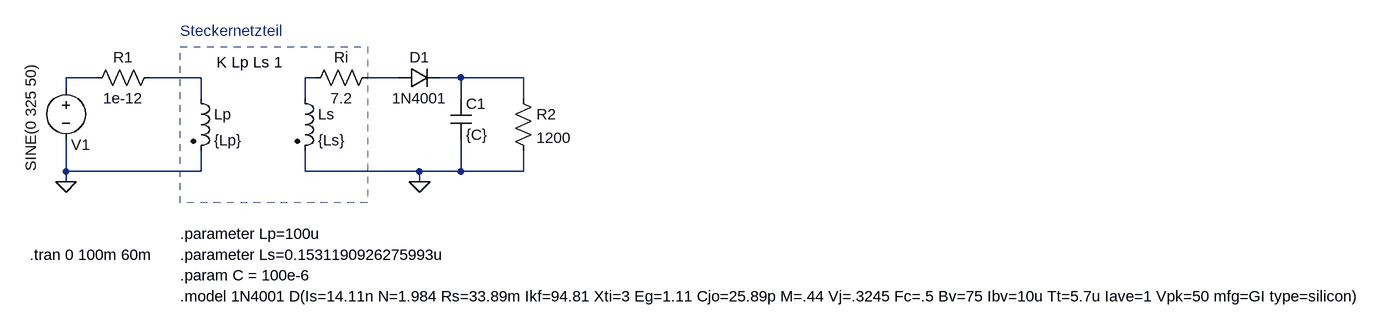
[diagram p0: schematic 101_lec_exercise_diode_einweg.asc]
101_lec_exercise_diode_einweg.asc, the LTspice schematic file:
Version 4
SHEET 1 2120 680
WIRE -48 48 -96 48
WIRE 112 48 32 48
WIRE 288 48 272 48
WIRE 416 48 368 48
WIRE 512 48 480 48
WIRE 608 48 512 48
WIRE -96 64 -96 48
WIRE 112 80 112 48
WIRE 272 80 272 48
WIRE 512 80 512 48
WIRE 608 80 608 48
WIRE -96 192 -96 144
WIRE 112 192 112 160
WIRE 112 192 -96 192
WIRE 272 192 272 160
WIRE 448 192 272 192
WIRE 512 192 512 144
WIRE 512 192 448 192
WIRE 608 192 608 160
WIRE 608 192 512 192
WIRE -96 208 -96 192
WIRE 448 208 448 192
FLAG -96 208 0
FLAG 448 208 0
SYMBOL voltage -96 48 R0
WINDOW 0 8 103 Left 2
WINDOW 3 -54 144 VLeft 2
WINDOW 123 0 0 Left 2
WINDOW 39 0 0 Left 2
SYMATTR InstName V1
SYMATTR Value SINE(0 325 50)
SYMBOL ind2 96 64 R0
SYMATTR InstName Lp
SYMATTR Value {Lp}
SYMATTR Type ind
SYMBOL ind2 256 64 R0
SYMATTR InstName Ls
SYMATTR Value {Ls}
SYMATTR Type ind
SYMBOL res 48 32 R90
WINDOW 0 0 56 VBottom 2
WINDOW 3 32 56 VTop 2
SYMATTR InstName R1
SYMATTR Value 1e-12
SYMBOL res 384 32 R90
WINDOW 0 0 56 VBottom 2
WINDOW 3 32 56 VTop 2
SYMATTR InstName Ri
SYMATTR Value 7.2
SYMBOL diode 416 64 R270
WINDOW 0 32 32 VTop 2
WINDOW 3 0 32 VBottom 2
SYMATTR InstName D1
SYMATTR Value 1N4001
SYMBOL cap 496 80 R0
SYMATTR InstName C1
SYMATTR Value {C}
SYMBOL res 592 64 R0
SYMATTR InstName R2
SYMATTR Value 1200
TEXT 136 24 Left 2 !K Lp Ls 1
TEXT 80 -24 Left 2 ;Steckernetzteil
TEXT 80 288 Left 2 !.parameter Lp=100u
TEXT 80 320 Left 2 !.parameter Ls=0.1531190926275993u
TEXT -152 320 Left 2 !.tran 0 100m 60m
TEXT 80 352 Left 2 !.param C = 100e-6
TEXT 80 384 Left 2 !.model 1N4001 D(Is=14.11n N=1.984 Rs=33.89m Ikf=94.81 Xti=3 Eg=1.11 Cjo=25.89p M=.44 Vj=.3245 Fc=.5 Bv=75 Ibv=10u Tt=5.7u Iave=1 Vpk=50 mfg=GI type=silicon)
RECTANGLE Normal 368 240 80 0 2

The netlist it stands for:
* 101_lec_exercise_diode_einweg.asc
V1 N001 0 SINE(0 325 50)
Lp N002 0 {Lp}
Ls N003 0 {Ls}
R1 N002 N001 1e-12
Ri N004 N003 7.2
D1 N004 N005 1N4001
C1 N005 0 {C}
R2 N005 0 1200
.model D D
.lib standard.dio
K Lp Ls 1
* Steckernetzteil
.parameter Lp=100u
.parameter Ls=0.1531190926275993u
.tran 0 100m 60m
.param C = 100e-6
.model 1N4001 D(Is=14.11n N=1.984 Rs=33.89m Ikf=94.81 Xti=3 Eg=1.11 Cjo=25.89p M=.44 Vj=.3245 Fc=.5 Bv=75 Ibv=10u Tt=5.7u Iave=1 Vpk=50 mfg=GI type=silicon)
.backanno
.end